# EAGLE design Hexagonal_MCU_V02 (EAGLE 7.7.0)

## Sheet 1 of 2
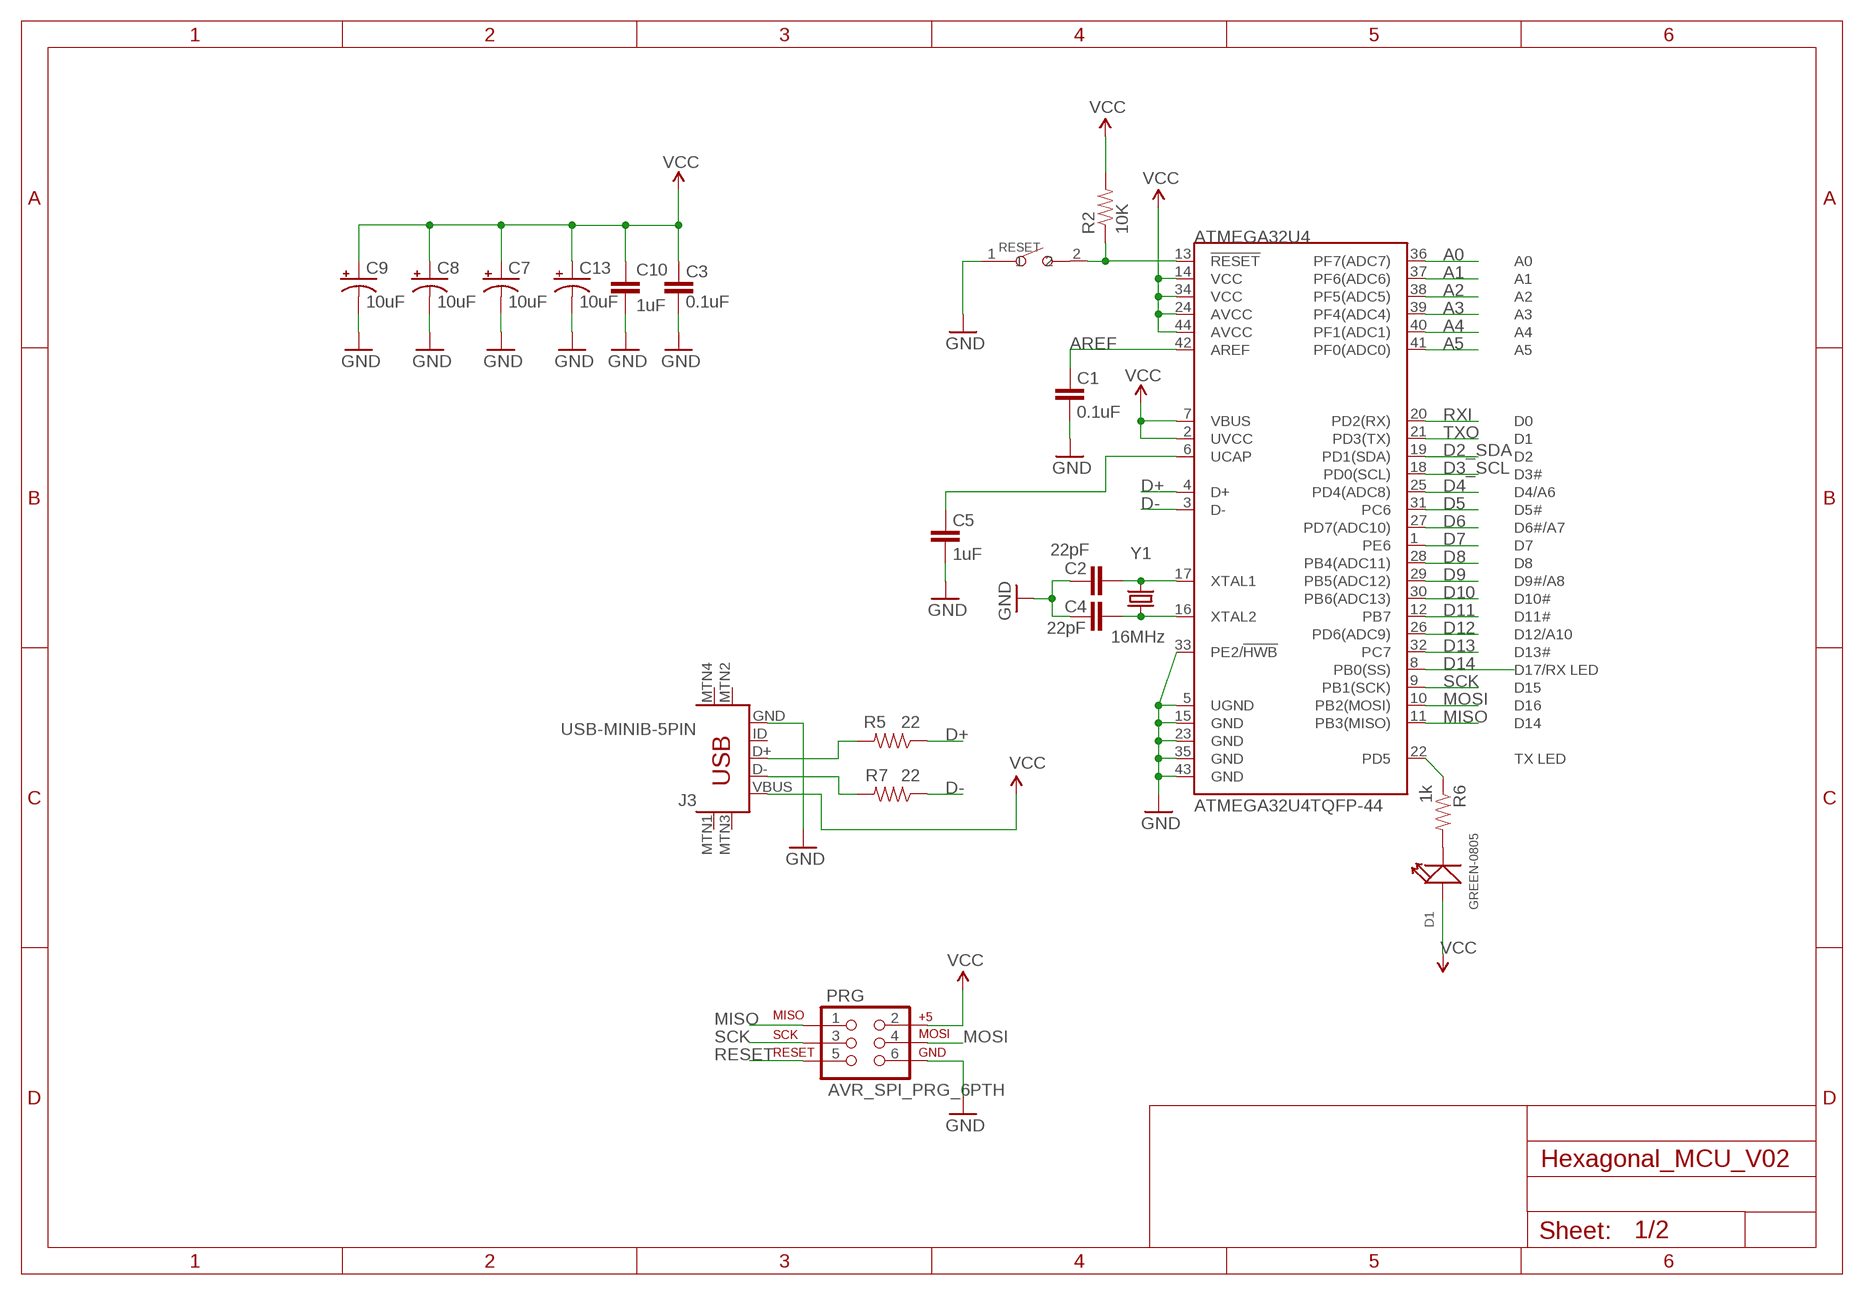
[diagram p0: schematic, sheet 1]

### Parts
ATMEGA32U4  ATMEGA32U4TQFP-44  [TQFP44]
C1  0.1uF  CAP0805  [0805]
C2  22pF  CAP0805  [0805]
C3  0.1uF  CAP0805  [0805]
C4  22pF  CAP0805  [0805]
C5  1uF  CAP0805  [0805]
C7  10uF  CAP_POL1206  [EIA3216]
C8  10uF  CAP_POL1206  [EIA3216]
C9  10uF  CAP_POL1206  [EIA3216]
C10  1uF  CAP0805  [0805]
C13  10uF  CAP_POL1206  [EIA3216]
D1  GREEN-0805  SMD-LED-CLEAR-GREEN(0805)  [LED-0805]
J3  USB-MINIB-5PIN  [USB-MINIB]
PRG  AVR_SPI_PRG_6PTH  [2X3]
R2  10K  RESISTOR0805-RES  [0805]
R5  22  RESISTOR0805-RES  [0805]
R6  1k  RESISTOR0805-RES  [0805]
R7  22  RESISTOR0805-RES  [0805]
RESET  B3U-1000P-2P-SMD  SMD-BUTTON(2P-4.0X3.0X1.5+0.5MM)SW-TS-017A-2P  [SW2-4.0X3.0X2.0]
Y1  16MHz  CRYSTALHC49US  [HC49US]

### Nets
5V [vcc]: ATMEGA32U4.2(UVCC) ATMEGA32U4.7(VBUS) ATMEGA32U4.14(VCC) ATMEGA32U4.24(AVCC) ATMEGA32U4.34(VCC) ATMEGA32U4.44(AVCC) C3.2 C7.A(+) C8.A(+) C9.A(+) C10.1 C13.A(+) D1.+ J3.VBUS PRG.2 R2.2 ; supply symbol labelled VCC ; also sheet 2
A0: ATMEGA32U4.36(PF7(ADC7))
A1: ATMEGA32U4.37(PF6(ADC6))
A2: ATMEGA32U4.38(PF5(ADC5))
A3: ATMEGA32U4.39(PF4(ADC4))
A4: ATMEGA32U4.40(PF1(ADC1))
A5: ATMEGA32U4.41(PF0(ADC0))
AREF: ATMEGA32U4.42(AREF) C1.2
D2_SDA: ATMEGA32U4.19(PD1(SDA)) ; also sheet 2
D3_SCL: ATMEGA32U4.18(PD0(SCL))
D4: ATMEGA32U4.25(PD4(ADC8))
D5: ATMEGA32U4.31(PC6) ; also sheet 2
D6: ATMEGA32U4.27(PD7(ADC10))
D7: ATMEGA32U4.1(PE6) ; also sheet 2
D8: ATMEGA32U4.28(PB4(ADC11)) ; also sheet 2
D9: ATMEGA32U4.29(PB5(ADC12))
D10: ATMEGA32U4.30(PB6(ADC13))
D11: ATMEGA32U4.12(PB7) ; also sheet 2
D12: ATMEGA32U4.26(PD6(ADC9))
D13: ATMEGA32U4.32(PC7)
D14: ATMEGA32U4.8(PB0(SS))
D+: ATMEGA32U4.4(D+) R5.1
D-: ATMEGA32U4.3(D-) R7.1
GND: ATMEGA32U4.5(UGND) ATMEGA32U4.15(GND) ATMEGA32U4.23(GND) ATMEGA32U4.33(PE2/!HWB) ATMEGA32U4.35(GND) ATMEGA32U4.43(GND) C1.1 C2.2 C3.1 C4.2 C5.1 C7.C(-) C8.C(-) C9.C(-) C10.2 C13.C(-) J3.GND PRG.6 RESET.1 ; also sheet 2
MISO: ATMEGA32U4.11(PB3(MISO)) PRG.1
MOSI: ATMEGA32U4.10(PB2(MOSI)) PRG.4
N$1: ATMEGA32U4.16(XTAL2) C4.1 Y1.1
N$2: ATMEGA32U4.17(XTAL1) C2.1 Y1.2
N$6: J3.D- R7.2
N$7: D1.- R6.2
N$8: J3.D+ R5.2
RESET: ATMEGA32U4.13(!RESET) PRG.5 R2.1 RESET.2
RXI: ATMEGA32U4.20(PD2(RX))
SCK: ATMEGA32U4.9(PB1(SCK)) PRG.3
TXLED: ATMEGA32U4.22(PD5) R6.1
TXO: ATMEGA32U4.21(PD3(TX))
UCAP: ATMEGA32U4.6(UCAP) C5.2
Unconnected: J3.ID J3.MTN1(MTN2) J3.MTN2(MTN3) J3.MTN3(MTN1) J3.MTN4

## Sheet 2 of 2
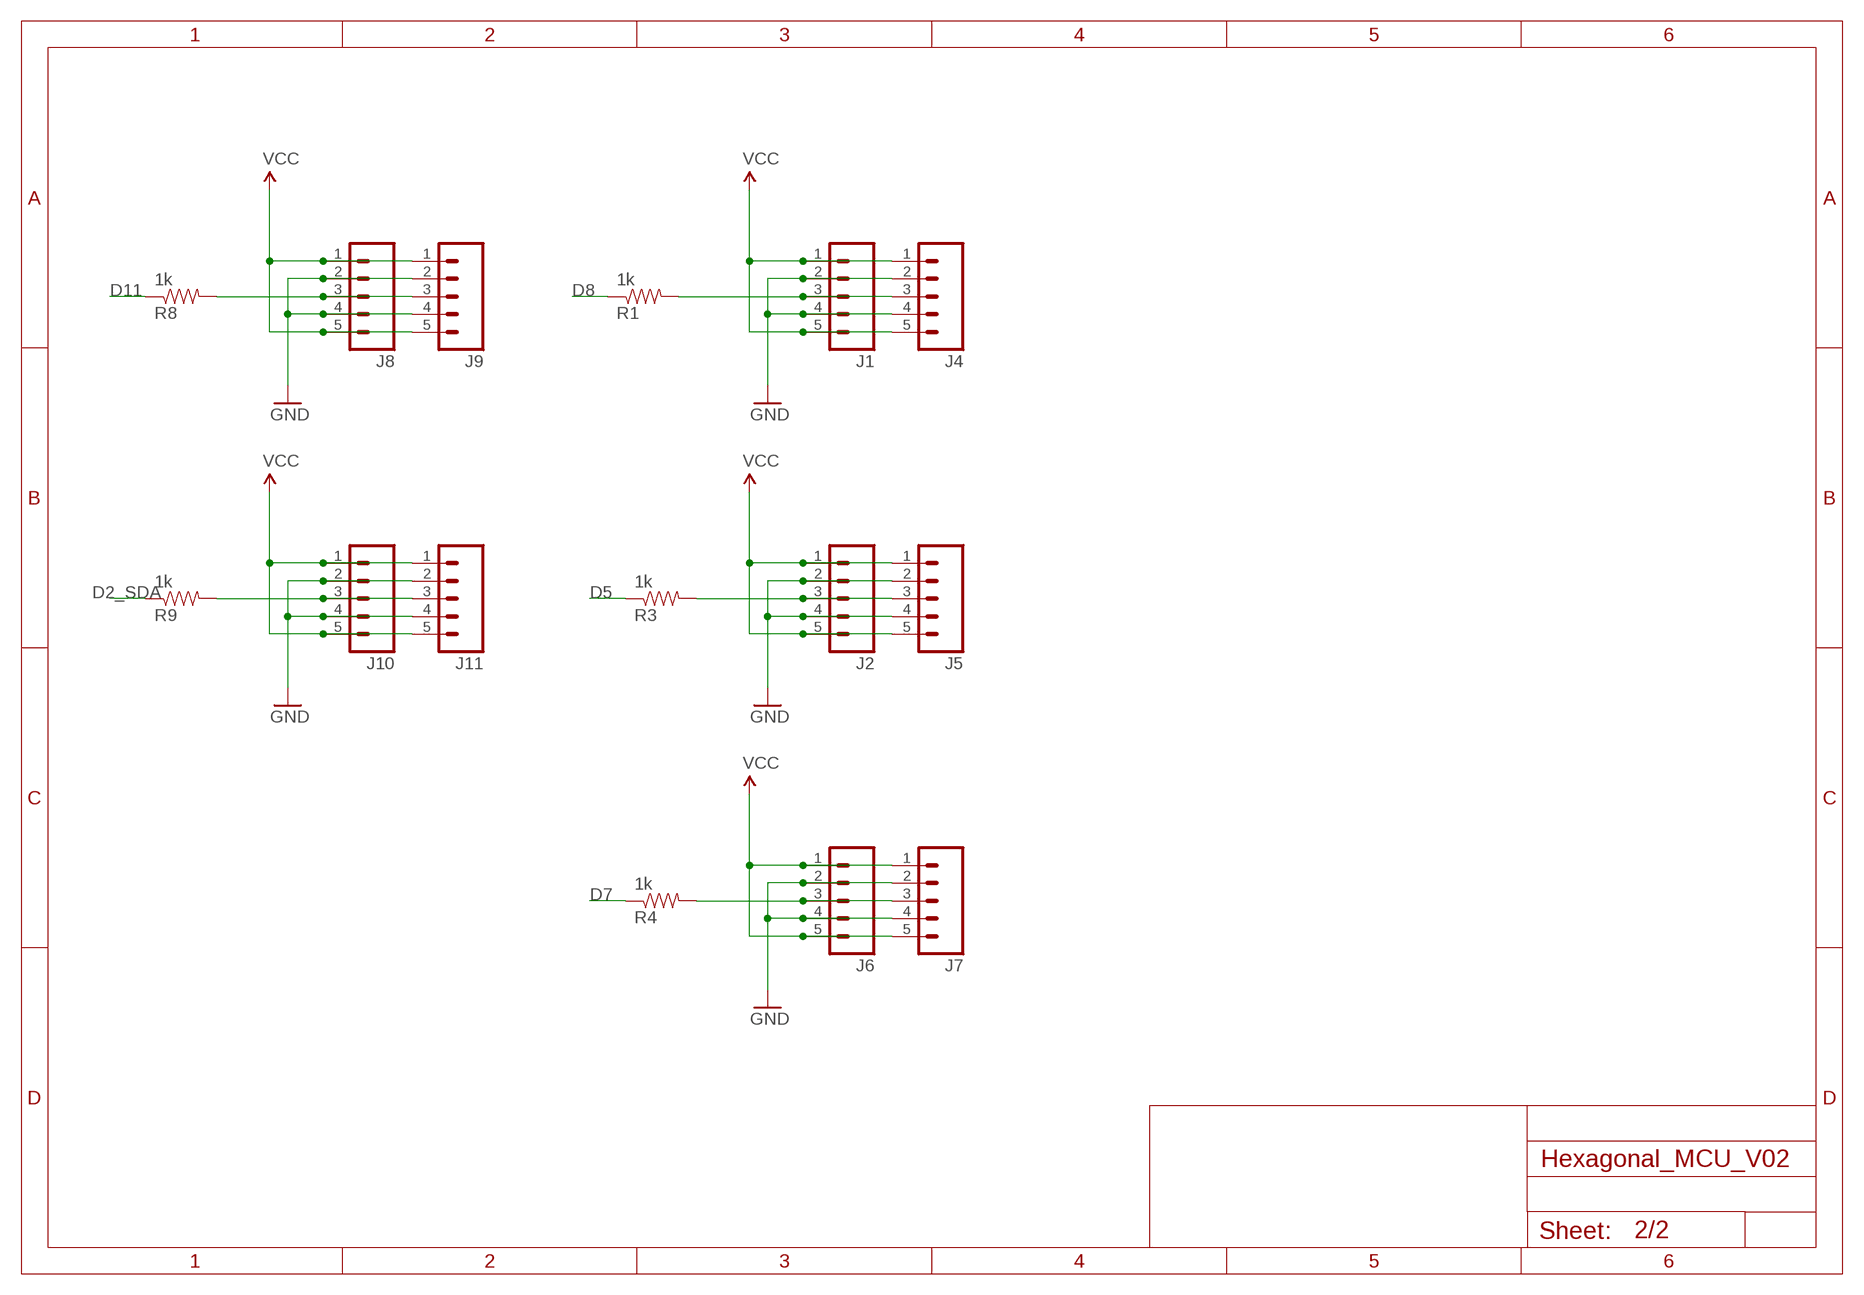
[diagram p1: schematic, sheet 2]

### Parts
J1  M05NO_SILK  [1X05_NO_SILK]
J2  M05NO_SILK  [1X05_NO_SILK]
J4  M05PTH_LONGPADS  [1X05_LONGPADS]
J5  M05PTH_LONGPADS  [1X05_LONGPADS]
J6  M05NO_SILK  [1X05_NO_SILK]
J7  M05PTH_LONGPADS  [1X05_LONGPADS]
J8  M05NO_SILK  [1X05_NO_SILK]
J9  M05PTH_LONGPADS  [1X05_LONGPADS]
J10  M05NO_SILK  [1X05_NO_SILK]
J11  M05PTH_LONGPADS  [1X05_LONGPADS]
R1  1k  RESISTOR0805-RES  [0805]
R3  1k  RESISTOR0805-RES  [0805]
R4  1k  RESISTOR0805-RES  [0805]
R8  1k  RESISTOR0805-RES  [0805]
R9  1k  RESISTOR0805-RES  [0805]

### Nets
5V [vcc]: J1.1 J1.5 J2.1 J2.5 J4.1 J4.5 J5.1 J5.5 J6.1 J6.5 J7.1 J7.5 J8.1 J8.5 J9.1 J9.5 J10.1 J10.5 J11.1 J11.5 ; supply symbol labelled VCC ; also sheet 1
D2_SDA: R9.1 ; also sheet 1
D5: R3.1 ; also sheet 1
D7: R4.1 ; also sheet 1
D8: R1.1 ; also sheet 1
D11: R8.1 ; also sheet 1
GND: J1.2 J1.4 J2.2 J2.4 J4.2 J4.4 J5.2 J5.4 J6.2 J6.4 J7.2 J7.4 J8.2 J8.4 J9.2 J9.4 J10.2 J10.4 J11.2 J11.4 ; also sheet 1
N$4: J2.3 J5.3 R3.2
N$5: J1.3 J4.3 R1.2
N$9: J6.3 J7.3 R4.2
N$10: J8.3 J9.3 R8.2
N$11: J10.3 J11.3 R9.2

## Library data of the parts
ATMEGA32U4 = SparkFun-DigitalIC:ATMEGA32U4: Atmel 44-pin 8-bit Microcontroller with 32KBytes of ISP Flash and USB Controller
C1-C5 C10 = SparkFun:CAP: Capacitor Standard 0603 ceramic capacitor, and 0.1" leaded capacitor.
C7-C9 C13 = SparkFun:CAP_POL: Capacitor Polarized These are standard SMD and PTH capacitors. Normally 10uF, 47uF, and 100uF in electrolytic and tantalum varieties. Always verify the external diameter of the through hole cap, it varies with capacity, voltage, and manufacturer. The EIA devices should be standard.
D1 = Seeed-LED-2016:SMD-LED-CLEAR-GREEN(0805): 304090057; MPN: 17-215SYGC/S530-E2/TR8
J1 J2 J4-J11 = SparkFun-Connectors:M05: Header 5 Standard 5-pin 0.1" header. Use with straight break away headers (SKU : PRT-00116), right angle break away headers (PRT-00553), swiss pins (PRT-00743), machine pins (PRT-00117), and female headers (PRT-00115). Molex polarized connector foot print use with SKU : PRT-08230 with associated crimp pins and housings.
J3 = SparkFun-Connectors:USB-MINIB: Mini-USB "B" connector with 5th pin broken out. Created new symbol breaking out 5th "ID" pin in mini/micro USB connector spec. See: http://en.wikipedia.org/wiki/Mini_usb#Cables. Uses same footprint as 4-pin symbol. Also added pins to connect to mounting / shield pads if required (probably not generally needed as signals aren't shielded once they leave the connector).; PROD_ID: CONN-08193
PRG = SparkFun-Connectors:AVR_SPI_PRG_6: AVR ISP 6 Pin This is the reduced ISP connector for AVR programming. Common on Arduino. This footprint will take up less PCB space and can be used with a 10-pin to 6-pin adapter such as SKU: BOB-08508 **Special note about "TEST_POINT" package. The stop mask is on the top side, so if you want your programming test points to be on the bottom of your board, make sure to place this package on the bottom side of the board. This also ensure that the orientation to program from the bottom side will be correct.
R1-R9 = SparkFun:RESISTOR: Resistor Basic schematic elements and footprints for 0603, 1206, and PTH resistors.
RESET = SMD_Button_Custom:SMD-BUTTON(2P-4.0X3.0X1.5+0.5MM): 311020047; MPN: B3U-1000P-2P-SMD
Y1 = SparkFun:CRYSTAL: Crystals Various standard crystals. Proven footprints. Spark Fun Electronics SKU : COM-00534

## Net classes
0 default: width 0.203 mm

## Board
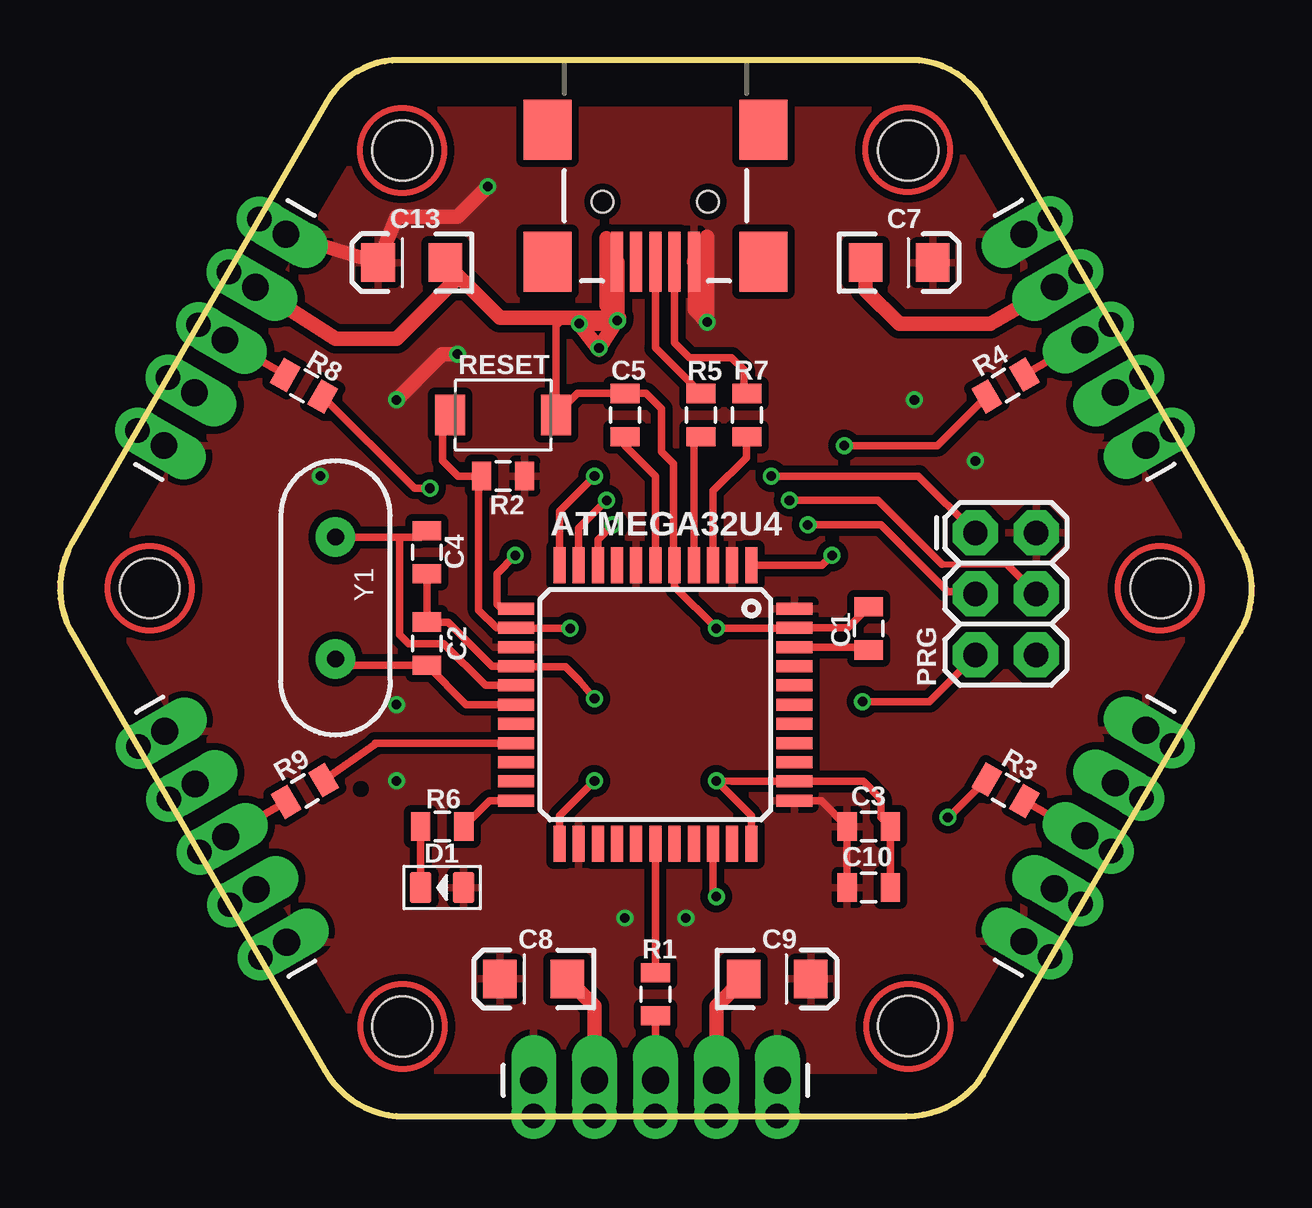
[diagram p2: board, top side]
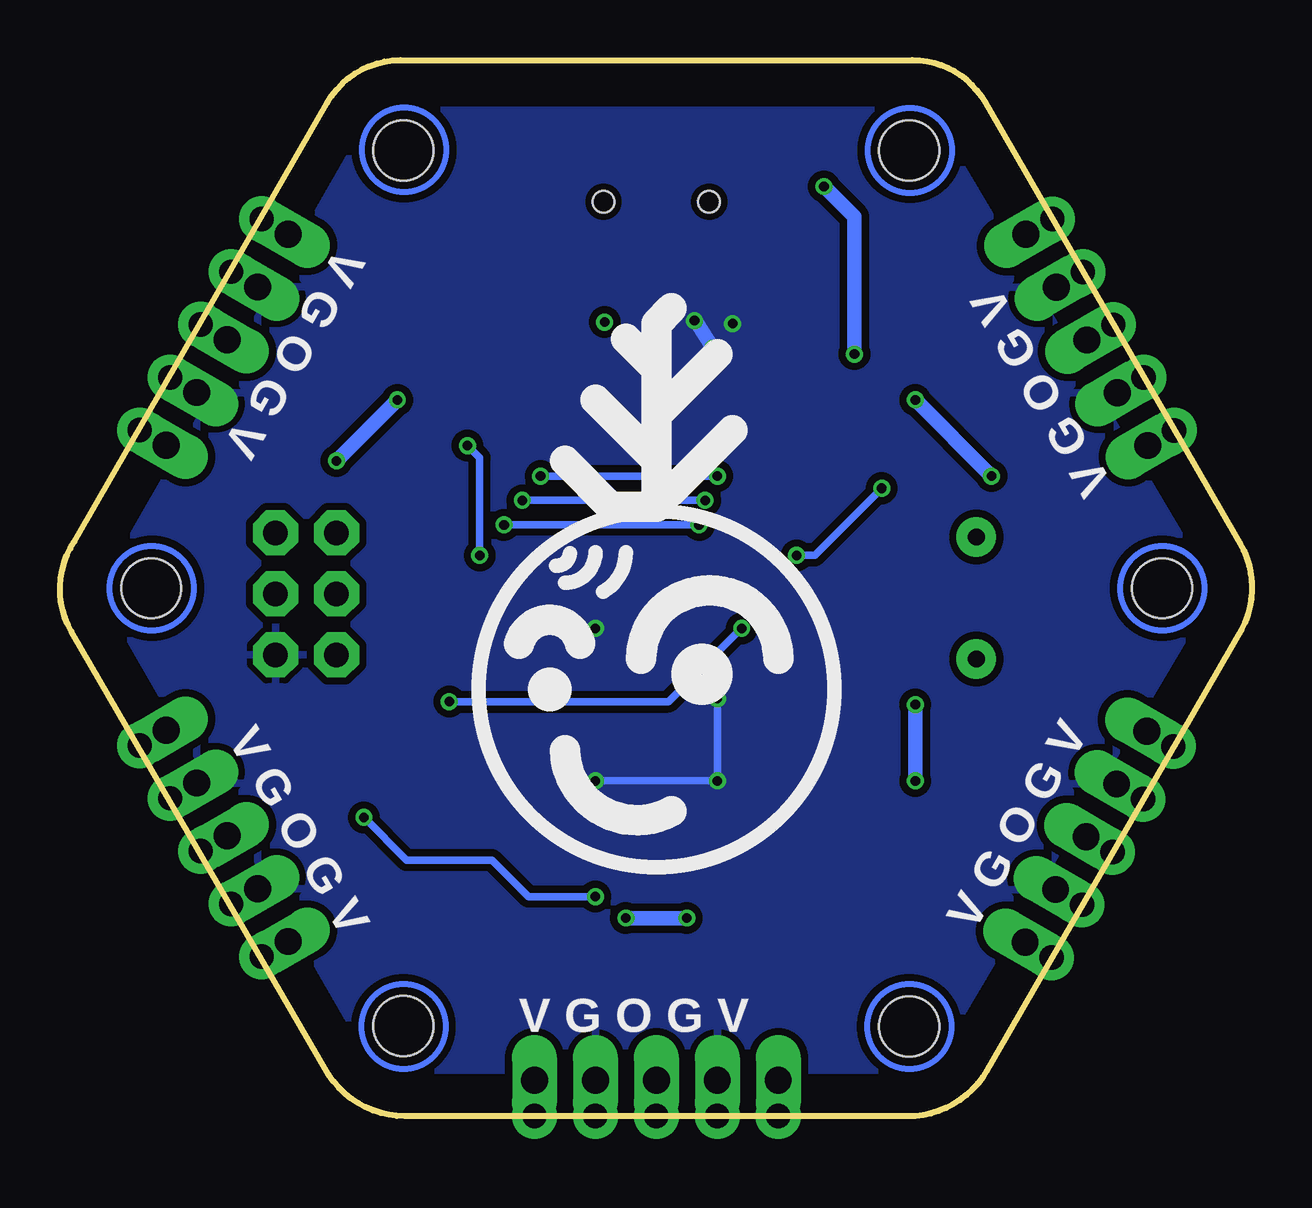
[diagram p3: board, bottom side, seen from below]

Size 49.68 x 44.01 mm. Coordinates in mm from the lower left corner, seen from the top.
Outline: 14.02,0 35.3,0 arc57 38.47,1.71 49.2,20.19 arc64 49.08,23.94 38.54,42.23 arc60 35.49,44.01 14.15,44.01 arc61 11.1,42.23 0.5,23.88 arc58 0.44,20.26 11.04,1.91 arc55 14.02,0
Copper layers (1*16): Top 0.035mm / dielectric 1.5mm / Bottom 0.035mm
Design rules "SeeedStudio_2layer_DRU_no_angle_20140221": minimum track width 6mil, minimum drill 12mil, track to track 6mil, track to pad 6mil, pad to pad 6mil, via to via 6mil, smd to smd 0mil, copper to edge 10mil, drill to drill 10mil, minimum pad ring 10mil, minimum via ring 6mil, stop-mask expansion 2mil, vias tented up to drill 100mil, thermal gap 10mil
Holes 2.5 mm at 35.36,3.76 14.28,3.73 45.88,22 35.36,40.23 14.28,40.23 3.74,22
tRestrict: area 8.6,9.6 to 8.8,9.7; area 12.5,13.6 to 12.6,13.7

### Footprints (pad centres in the part's own frame; a part is rotated, then mirrored left to right if it is on the bottom)
TQFP44 = smd 1.5 x 0.5: 1 -5.8,4; 2 -5.8,3.2; 3 -5.8,2.4; 4 -5.8,1.6; 5 -5.8,0.8; 6 -5.8,0; 7 -5.8,-0.8; 8 -5.8,-1.6; 9 -5.8,-2.4; 10 -5.8,-3.2; 11 -5.8,-4; 23 5.8,-4; 24 5.8,-3.2; 25 5.8,-2.4; 26 5.8,-1.6; 27 5.8,-0.8; 28 5.8,0; 29 5.8,0.8; 30 5.8,1.6; 31 5.8,2.4; 32 5.8,3.2; 33 5.8,4 | smd 0.5 x 1.5: 12 -4,-5.8; 13 -3.2,-5.8; 14 -2.4,-5.8; 15 -1.6,-5.8; 16 -0.8,-5.8; 17 0,-5.8; 18 0.8,-5.8; 19 1.6,-5.8; 20 2.4,-5.8; 21 3.2,-5.8; 22 4,-5.8; 34 4,5.8; 35 3.2,5.8; 36 2.4,5.8; 37 1.6,5.8; 38 0.8,5.8; 39 0,5.8; 40 -0.8,5.8; 41 -1.6,5.8; 42 -2.4,5.8; 43 -3.2,5.8; 44 -4,5.8
0805 = smd 0.8 x 1.2: 1 -0.9,0; 2 0.9,0
EIA3216 = smd 1.4 x 1.6: A 1.4,0; C -1.4,0
LED-0805 = smd 0.889 x 1.27: + -0.889,0; - 0.889,0
1X05_NO_SILK = drill 1.016 pad 1.88: 1 0,0; 2 2.54,0; 3 5.08,0; 4 7.62,0; 5 10.16,0
USB-MINIB = smd 2.5 x 0.5: D+ 2.5,0; D- 2.5,0.8; GND 2.5,-1.6; ID 2.5,-0.8; VBUS 2.5,1.6 | smd 2.5 x 2: MTN1 -3,4.5; MTN2 2.5,4.5; MTN3 -3,-4.5; MTN4 2.5,-4.5 | hole 0.9: 0,2.2; 0,-2.2
1X05_LONGPADS = drill 1.118 pad 1.88 long: 1 0,0; 2 2.54,0; 3 5.08,0; 4 7.62,0; 5 10.16,0
2X3 = drill 1.016 pad 1.88 octagon: 1 0,0; 2 0,2.54; 3 2.54,0; 4 2.54,2.54; 5 5.08,0; 6 5.08,2.54
SW2-4.0X3.0X2.0 = smd 1.25 x 1.7: 1 -2.2,0; 2 2.2,0
HC49US = drill 0.7 pad 1.651: 1 -2.54,0; 2 2.54,0

### Placement (x,y rotation side)
ATMEGA32U4  24.82,17.14 270 top
C1  33.71,20.32 270 top
C2  15.29,19.68 90 top
C3  33.71,12.06 180 top
C4  15.29,23.5 270 top
C5  23.55,29.21 270 top
C7  34.98,35.56 0 top
C8  19.74,5.71 180 top
C9  29.9,5.71 0 top
C10  33.71,9.53 0 top
C13  14.66,35.56 180 top
D1  15.93,9.53 180 top
J1  29.9,0 180 top
J2  41.27,6.64 60 top
J3  24.82,38.1 270 top
J4  29.9,1.5 180 top
J5  40.17,7.28 60 top
J6  46.35,28.58 120 top
J7  45.25,27.95 120 top
J8  8.31,37.37 240 top
J9  9.41,36.74 240 top
J10  3.27,15.41 300 top
J11  4.37,16.04 300 top
PRG  38.15,24.3 270 top
R1  24.82,5.08 270 top
R2  18.47,26.67 0 top
R3  39.41,13.58 330 top
R4  39.41,30.44 30 top
R5  26.72,29.21 90 top
R6  15.93,12.06 180 top
R7  28.63,29.21 90 top
R8  10.17,30.43 150 top
R9  10.21,13.55 210 top
RESET  18.47,29.21 180 top
Y1  11.48,21.59 270 top

### Tracks (layer width: path | path; a pad name or v marks a point on that pad's centre or on a via)
5V  (via drill 0.4)
  Top 0.305: ATMEGA32U4.34 31.73,13.14 C3.2 C10.1 | J1.5 J4.5 | J1.1 J4.1 | J2.1 J5.1 | J2.5 J5.5 | J7.1 J6.1 | J6.5 J7.5 | J8.1 J9.1 | J9.5 J8.5 | J11.1 J10.1 | J11.5 J10.5
  Top 0.61: J3.VBUS 26.47,35.55 26.47,33.59 v26.98,33.08 26.98,36.64 | J9.1 C13.A 14.02,37.47 16.56,37.47 v17.83,38.73 | v14.02,29.84 15.93,31.75 v16.56,31.75
  Bottom 0.61: v23.55,8.26 v26.09,8.26 | v14.02,13.97 v14.02,17.14 | v10.85,26.67 v14.02,29.84 | v35.61,29.84 v38.15,27.3 | v16.56,31.75 16.56,37.47 v17.83,38.73
  pour Top (isolate 0.305): 14.66,1.91 34.98,1.91 37.52,3.81 47.04,20.32 47.04,23.5 36.88,41.27 34.98,41.91 14.02,41.91 12.75,40.64 2.59,23.5 2.59,20.32 12.75,3.17
AREF
  Top 0.305: ATMEGA32U4.42 33.58,19.55 C1.2
D2_SDA
  Top 0.305: ATMEGA32U4.19 13.14,15.54 13.14,15.49 R9.1
D5  (via drill 0.4)
  Top 0.305: ATMEGA32U4.31 27.22,9.28 v27.36,9.14 | v37.01,12.45 37.05,12.45 R3.1
  Bottom 0.305: v27.36,9.14 30.15,9.14 31.68,10.67 35.23,10.67 v37.01,12.45
D7  (via drill 0.4)
  Top 0.305: ATMEGA32U4.1 31.76,22.95 v32.19,23.37 | v32.69,27.94 36.58,27.94 R4.1
  Bottom 0.305: v32.19,23.37 32.19,27.43 v32.69,27.94
D8
  Top 0.305: R1.1 ATMEGA32U4.28
D11  (via drill 0.4)
  Top 0.305: ATMEGA32U4.12 18.41,21.14 18.22,21.34 18.22,22.61 v18.98,23.37 | v15.42,26.16 14.78,26.16 R8.1
  Bottom 0.305: v18.98,23.37 18.22,23.37 v15.42,26.16
D+
  Top 0.305: ATMEGA32U4.4 26.42,28 R5.1
D-
  Top 0.305: ATMEGA32U4.3 27.22,26.05 28.6,27.43 28.6,28.29 R7.1
GND  (via drill 0.4)
  Top 0.305: C4.2 C2.2 16.18,20.57 18.01,18.75 ATMEGA32U4.15 19.03,18.73 21.07,18.73 21.64,18.16 v22.28,17.4 | C1.1 32.83,20.34 ATMEGA32U4.43 30.59,20.32 v27.36,20.32 25.62,22.06 ATMEGA32U4.5 25.58,22.98 25.58,27.18 25.07,27.69 25.07,29.46 24.43,30.11 C5.1 21.57,30.11 RESET.1 20.67,32.93 21.01,33.27 | C10.2 C3.1 34.22,12.46 34.22,13.21 33.48,13.95 ATMEGA32U4.35 28.02,13.95 v27.36,13.97 28.82,12.51 ATMEGA32U4.33 | ATMEGA32U4.23 20.82,12.51 v22.28,13.97 | J1.4 J4.4 | J1.2 J4.2 | J2.2 J5.2 | J2.4 J5.4 | J6.2 J7.2 | J6.4 J7.4 | J8.2 8.31,34.29 J9.2 | J9.4 J8.4 | J10.2 J11.2 | J11.4 J10.4
  Top 0.61: 23.23,33.21 23.23,35.59 J3.GND 22.79,36.03 | 23.23,33.21 v23.23,33.15 | 22.79,36.03 22.79,36.58 | 22.79,36.03 22.79,33.78 23.3,33.27 21.01,33.27 18.35,33.27 C13.C | J4.2 27.36,4.58 C9.C | J4.4 22.28,4.58 C8.C | C7.C 33.58,34.42 34.98,33.02 38.79,33.02 J7.4 | J9.2 11.48,32.38 14.02,32.38 16.56,34.92 15.93,35.56 | v22.47,32 22.47,31.94 v21.64,33.02 | 23.23,33.21 v22.47,32 | v22.47,32 v21.64,33.02 | v21.64,33.02 22.91,33.02
  Bottom 0.305: v27.36,13.97 v22.28,13.97 v22.28,17.4
  Bottom 0.61: v23.23,33.15 23.11,33.02 v22.47,32
  pour Bottom (isolate 0.305): 14.66,1.91 34.98,1.91 37.52,3.81 47.04,20.32 47.04,23.5 36.88,41.27 34.98,41.91 14.02,41.91 12.75,40.64 2.59,23.5 2.59,20.32 12.75,3.17
MISO  (via drill 0.4)
  Top 0.305: ATMEGA32U4.11 20.82,25.21 v22.28,26.67 | v29.65,26.67 35.78,26.67 PRG.1
  Bottom 0.305: v22.28,26.67 v29.65,26.67
MOSI  (via drill 0.4)
  Top 0.254: 36.76,22.99 39.47,22.99
  Top 0.305: ATMEGA32U4.10 21.62,24.49 v22.79,25.65 | v30.41,25.65 34.09,25.65 36.76,22.99 | 39.47,22.99 PRG.4
  Bottom 0.305: v22.79,25.65 v30.41,25.65
N$1
  Top 0.305: Y1.1 14.15,24.13 | 14.15,24.13 15.03,24.13 C4.1 | ATMEGA32U4.16 17.73,17.95 15.99,19.68 14.53,19.68 14.15,20.07 14.15,24.13
N$2
  Top 0.305: Y1.2 11.75,18.79 C2.1 16.93,17.14 ATMEGA32U4.17
N$4
  Top 0.305: R3.2 J5.3 J2.3
N$5
  Top 0.305: R1.2 J4.3 J1.3
N$6
  Top 0.305: J3.D- 25.62,32.22 26.24,31.6 27.99,31.6 28.5,31.09 28.5,30.24 R7.2
N$7
  Top 0.305: R6.2 D1.-
N$8
  Top 0.305: J3.D+ 24.82,32.02 R5.2
N$9
  Top 0.305: R4.2 J7.3 J6.3
N$10
  Top 0.305: R8.2 J9.3 J8.3
N$11
  Top 0.305: R9.2 J11.3 J10.3
RESET  (via drill 0.4)
  Top 0.305: RESET.2 15.95,28.89 15.95,27.3 16.59,26.67 R2.1 17.45,26.55 17.45,21.08 18.19,20.34 ATMEGA32U4.13 19.04,20.32 v21.26,20.32 | PRG.5 38.15,19.18 36.25,17.27 v33.46,17.27
  Bottom 0.305: v33.46,17.27 24.31,17.27 v21.26,20.32
SCK  (via drill 0.4)
  Top 0.305: ATMEGA32U4.9 22.42,24.02 v23.04,24.64 | v31.17,24.64 34.22,24.64 37.01,21.84 38.07,21.84 PRG.3
  Bottom 0.305: v23.04,24.64 v31.17,24.64
TXLED
  Top 0.305: ATMEGA32U4.22 17.91,13.14 R6.1
UCAP
  Top 0.305: C5.2 23.55,27.94 24.82,26.67 ATMEGA32U4.6
(copper drawn outside any net)
  shapes: Bottom circle x6, Top circle x6

### Text on the board
bPlace: V G O G V | V G O G V | V G O G V | V G O G V | V G O G V